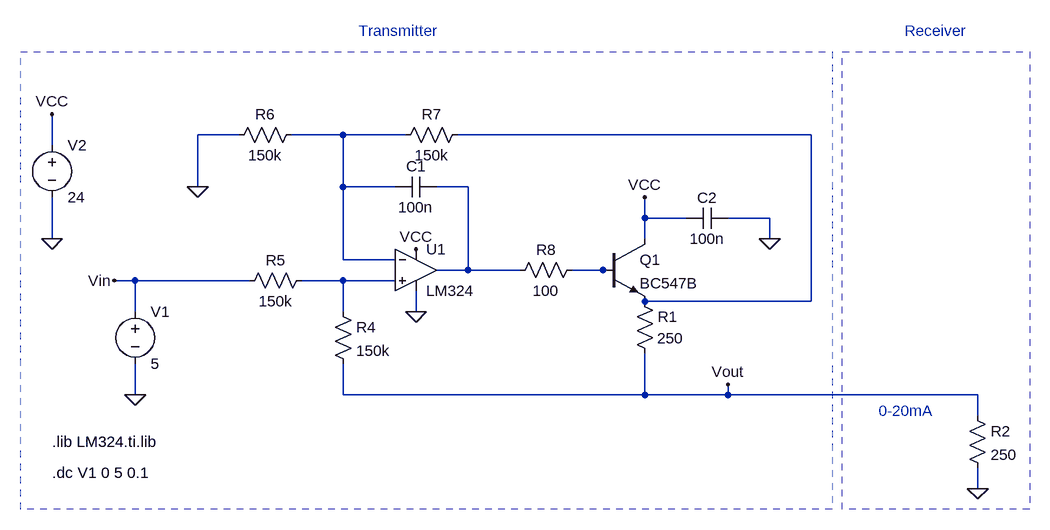
[diagram p0: schematic transmitter_circuit.asc]
transmitter_circuit.asc, the LTspice schematic file:
Version 4
SHEET 1 1916 980
WIRE -96 224 -160 224
WIRE 64 224 -16 224
WIRE 160 224 64 224
WIRE 784 224 240 224
WIRE -384 240 -384 192
WIRE -160 304 -160 224
WIRE 64 304 64 224
WIRE 144 304 64 304
WIRE 256 304 208 304
WIRE 528 352 528 320
WIRE 592 352 528 352
WIRE 720 352 656 352
WIRE -384 384 -384 320
WIRE 528 384 528 352
WIRE 720 384 720 352
WIRE 64 416 64 304
WIRE 144 416 64 416
WIRE 256 432 256 304
WIRE 256 432 208 432
WIRE 336 432 256 432
WIRE 464 432 416 432
WIRE 480 432 464 432
WIRE -256 448 -288 448
WIRE -80 448 -256 448
WIRE 64 448 0 448
WIRE 144 448 64 448
WIRE 784 480 784 224
WIRE 784 480 528 480
WIRE -256 496 -256 448
WIRE 64 496 64 448
WIRE 176 496 176 464
WIRE -256 624 -256 576
WIRE 64 624 64 576
WIRE 528 624 528 560
WIRE 528 624 64 624
WIRE 656 624 656 608
WIRE 656 624 528 624
WIRE 1040 624 656 624
WIRE 1040 656 1040 624
WIRE 1040 768 1040 736
FLAG -384 192 VCC
FLAG -384 384 0
FLAG 176 400 VCC
FLAG -256 624 0
FLAG -160 304 0
FLAG 528 320 VCC
FLAG 176 496 0
FLAG 720 384 0
FLAG 1040 768 0
FLAG -288 448 Vin
FLAG 656 608 Vout
SYMBOL voltage -384 224 R0
WINDOW 123 0 0 Left 2
WINDOW 39 0 0 Left 0
SYMATTR InstName V2
SYMATTR Value 24
SYMBOL npn 464 384 R0
SYMATTR InstName Q1
SYMATTR Value BC547B
SYMBOL voltage -256 480 R0
WINDOW 123 0 0 Left 0
WINDOW 39 0 0 Left 0
SYMATTR InstName V1
SYMATTR Value 5
SYMBOL res 16 432 R90
WINDOW 0 0 56 VBottom 2
WINDOW 3 32 56 VTop 2
SYMATTR InstName R5
SYMATTR Value 150k
SYMBOL res 0 208 R90
WINDOW 0 0 56 VBottom 2
WINDOW 3 32 56 VTop 2
SYMATTR InstName R6
SYMATTR Value 150k
SYMBOL res 256 208 R90
WINDOW 0 0 56 VBottom 2
WINDOW 3 32 56 VTop 2
SYMATTR InstName R7
SYMATTR Value 150k
SYMBOL res 48 480 R0
SYMATTR InstName R4
SYMATTR Value 150k
SYMBOL res 512 464 R0
WINDOW 3 35 73 Left 2
SYMATTR Value 250
SYMATTR InstName R1
SYMBOL res 432 416 R90
WINDOW 0 0 56 VBottom 2
WINDOW 3 32 56 VTop 2
SYMATTR InstName R8
SYMATTR Value 100
SYMBOL cap 208 288 R90
WINDOW 0 0 32 VBottom 2
WINDOW 3 32 32 VTop 2
SYMATTR InstName C1
SYMATTR Value 100n
SYMBOL OpAmps\\opamp2 176 368 R0
SYMATTR InstName U1
SYMATTR Value LM324
SYMBOL cap 656 336 R90
WINDOW 0 0 32 VBottom 2
WINDOW 3 32 32 VTop 2
SYMATTR InstName C2
SYMATTR Value 100n
SYMATTR SpiceLine Irms=0 Rser=0 Lser=0
SYMBOL res 1024 640 R0
SYMATTR InstName R2
SYMATTR Value 250
TEXT -384 744 Left 2 !.dc V1 0 5 0.1
TEXT -384 696 Left 2 !.lib LM324.ti.lib
TEXT 888 648 Left 2 ;0-20mA
TEXT 88 64 Left 2 ;Transmitter
TEXT 928 64 Left 2 ;Receiver
RECTANGLE Normal 816 800 -432 96 2
RECTANGLE Normal 1120 800 832 96 2

The netlist it stands for:
* transmitter_circuit.asc
V2 VCC 0 24
Q1 VCC N004 N002 0 BC547B
V1 Vin 0 5
R5 N005 Vin 150k
R6 N001 0 150k
R7 N002 N001 150k
R4 N005 Vout 150k
R1 N002 Vout 250
R8 N004 N003 100
C1 N003 N001 100n
XU1 N005 N001 VCC 0 N003 LM324  ; pins In+ In- V+ V- OUT
C2 0 VCC 100n Irms=0 Rser=0 Lser=0
R2 Vout 0 250
.model NPN NPN
.model PNP PNP
.lib standard.bjt
.dc V1 0 5 0.1
.lib LM324.ti.lib
* 0-20mA
* Transmitter
* Receiver
.backanno
.end

* Results of the author's LTspice run, read from the files saved beside the schematic
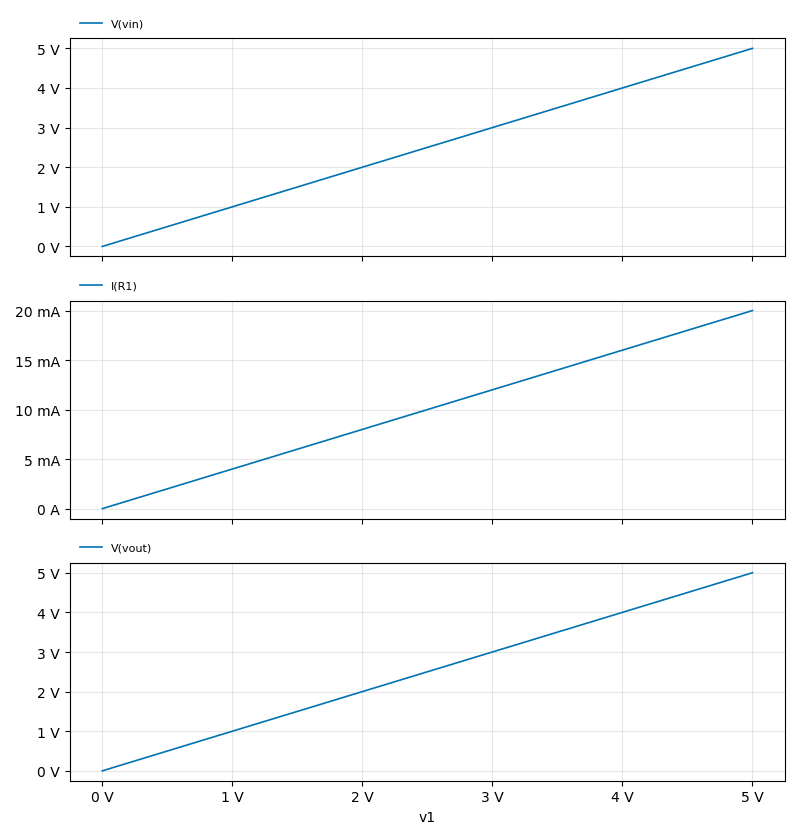
[diagram p1: DC transfer characteristic of transmitter_circuit.asc, plotted from the saved traces]
* DC transfer characteristic, 1 run:
*   V(vin): 0 V at v1=0 V, 5 V at v1=5 V, min 0 V, max 5 V
*   I(R1): 6.064 µA at v1=0 V, 20 mA at v1=5 V, min 6.064 µA, max 20 mA
*   V(vout): 1.517 mV at v1=0 V, 5.001 V at v1=5 V, min 1.517 mV, max 5.001 V